# EAGLE design tracker2 (EAGLE 6.5.0)
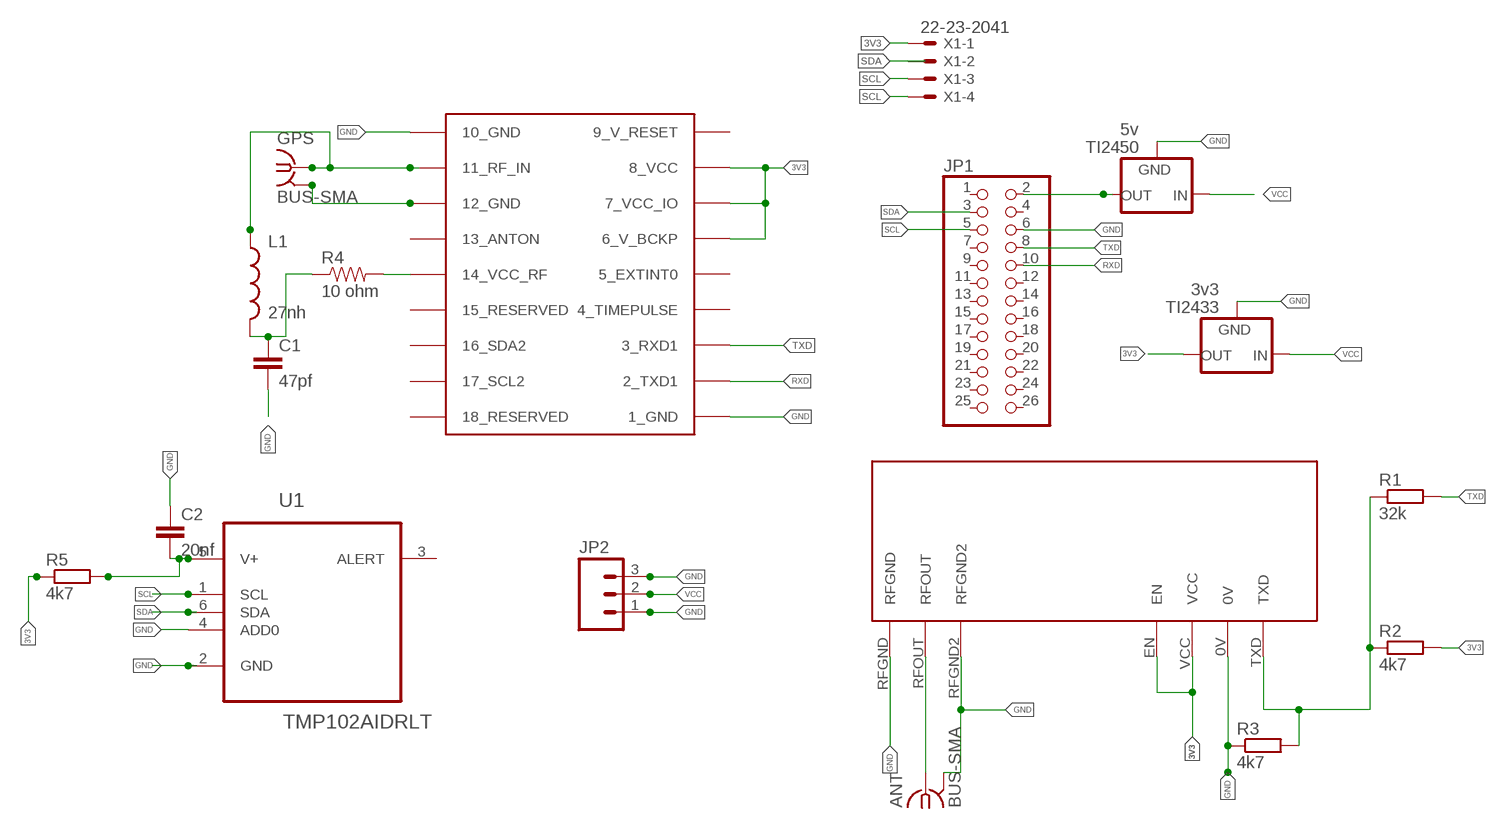
[diagram p0: schematic, sheet 1]

## Parts
ANT  BUS-SMA  [BUS-SMA]
C1  47pf  CAP0603-CAP  [0603-CAP]
C2  20nf  C-EUC0603  [C0603]
GPS  BUS-SMA  [BUS-SMA]
JP1  PINHD-2X13  [2X13]
JP2  M03PTH  [1X03]
L1  27nh  INDUCTOR0603  [0603]
R1  32k  R-EU_R0603  [R0603]
R2  4k7  R-EU_R0603  [R0603]
R3  4k7  R-EU_R0603  [R0603]
R4  10 ohm  RESISTOR0603  [0603-RES]
R5  4k7  R-EU_R0603  [R0603]
TI2433  3v3  V_REG_78XX-TO-220  [TO-220-ALT]
TI2450  5v  V_REG_78XX-TO-220  [TO-220-ALT]
U1  TMP102AIDRLT  [SOT50P160X60-6N]
U$1  NTX2  [NTX2]
U$2  UBLOX_MAX  [UBLOX_MAX]
X1  22-23-2041  [22-23-2041]

## Nets
3V3: C2.2 R2.2 R5.1 R5.2 TI2433.OUT U1.5(V+) U$1.EN U$1.VCC U$2.6_V_BCKP U$2.7_VCC_IO U$2.8_VCC X1.1
GND: ANT.2(GND) ANT.3(GND) ANT.4(GND) ANT.5(GND) C1.2 C2.1 GPS.2(GND) GPS.3(GND) GPS.4(GND) GPS.5(GND) JP1.6 JP2.1 JP2.3 R3.1 TI2433.GND TI2450.GND U1.2(GND) U1.4(ADD0) U$1.0V U$1.RFGND U$1.RFGND2 U$2.1_GND U$2.10_GND U$2.12_GND X1.4
N$1: JP1.2 TI2450.OUT
N$2: R4.2 U$2.14_VCC_RF
N$3: C1.1 L1.2 R4.1
N$6: R1.1 R2.1 R3.2 U$1.TXD
N$9: ANT.1 U$1.RFOUT
N$13: GPS.1 L1.1 U$2.11_RF_IN
RXD: JP1.10 U$2.2_TXD1
SCL: JP1.5 U1.1(SCL) X1.3
SDA: JP1.3 U1.6(SDA) X1.2
TXD: JP1.8 R1.2 U$2.3_RXD1
VCC: JP2.2 TI2433.IN TI2450.IN
Unconnected: JP1.1 JP1.4 JP1.7 JP1.9 JP1.11 JP1.12 JP1.13 JP1.14 JP1.15 JP1.16 JP1.17 JP1.18 JP1.19 JP1.20 JP1.21 JP1.22 JP1.23 JP1.24 JP1.25 JP1.26 U1.3(ALERT) U$2.4_TIMEPULSE U$2.5_EXTINT0 U$2.13_ANTON U$2.15_RESERVED U$2.16_SDA2 U$2.17_SCL2 U$2.18_RESERVED

## Power pins joined to a net without a drawn wire
9_V_RESET: U$2.9_V_RESET

## Library data of the parts
ANT GPS = Ava:BUS-SMA
C1 = SparkFun-Capacitors:CAP: Capacitor Standard 0603 ceramic capacitor, and 0.1" leaded capacitor.
C2 = rcl:C-EU: CAPACITOR, European symbol
JP1 = pinhead:PINHD-2X13: PIN HEADER
JP2 = SparkFun-Connectors:M03: Header 3 Standard 3-pin 0.1" header. Use with straight break away headers (SKU : PRT-00116), right angle break away headers (PRT-00553), swiss pins (PRT-00743), machine pins (PRT-00117), and female headers (PRT-00115). Molex polarized connector foot print use with SKU : PRT-08232 with associated crimp pins and housings.
L1 = SparkFun-Passives:INDUCTOR: Inductors Basic Inductor/Choke - 0603 and 1206. Footprints are not proven and vary greatly between part numbers. SRN6045- 33uH, 20% 1.4A SDR0403-560KL - 56uH, 10%, 500mA RMS/740mA peak
R1-R3 R5 = rcl:R-EU_: RESISTOR, European symbol
R4 = SparkFun-Resistors:RESISTOR: Resistor Basic schematic elements and footprints for 0603, 1206, and PTH resistors.
TI2433 TI2450 = SparkFun-PowerIC:V_REG_78XX: Voltage Regulator Standard 7805 5V regulator. IGO (Input Ground Output). Spark Fun Electronics SKU : COM-00107
U1 = Ava:TMP102AIDRLT: Temperature Sensor; MPN: TMP102AIDRLT; OC_FARNELL: 1652477; OC_NEWARK: 53M3987; PACKAGE: SOT-23-6; SUPPLIER: Texas Instruments
U$1 = Ava:NTX2: Radiometrix NTX2 Transmitter Module Author Anthony Stirk / http://ava.upuaut.net
U$2 = Ava:UBLOX_MAX: UBLOX MAX
X1 = con-molex:22-23-2041: .100" (2.54mm) Center Header - 4 Pin; MF: MOLEX; MPN: 22-23-2041; OC_FARNELL: 1462920; OC_NEWARK: 38C0355

## Net classes
0 default: clearance 0.205 mm

## Board
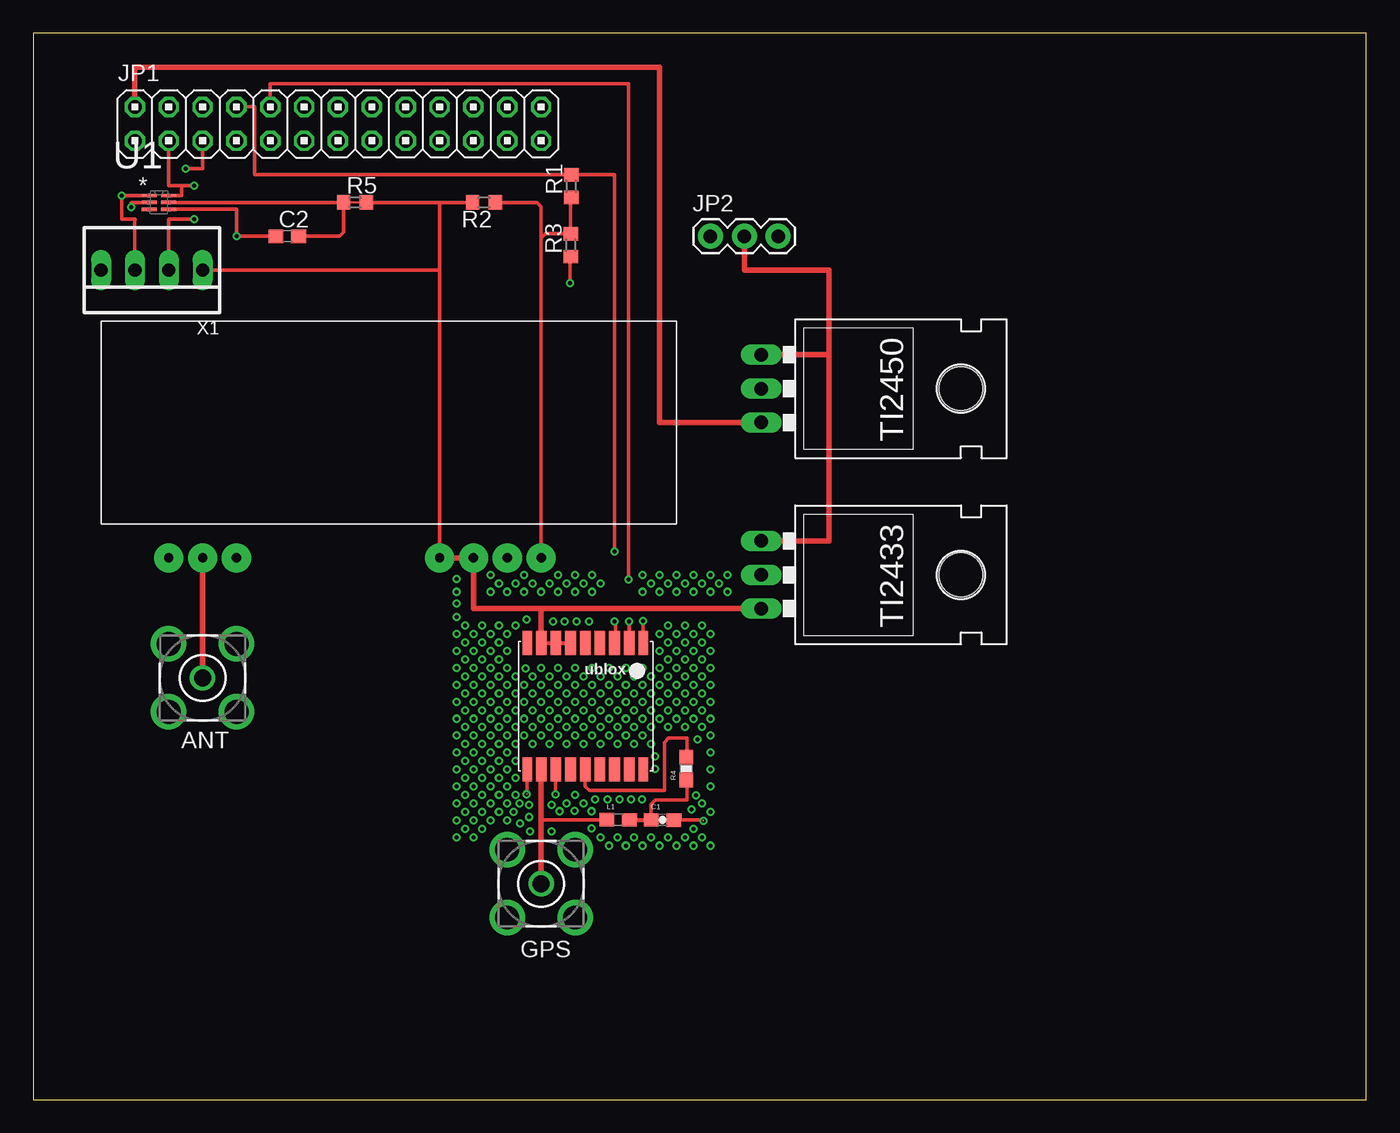
[diagram p1: board, top side]
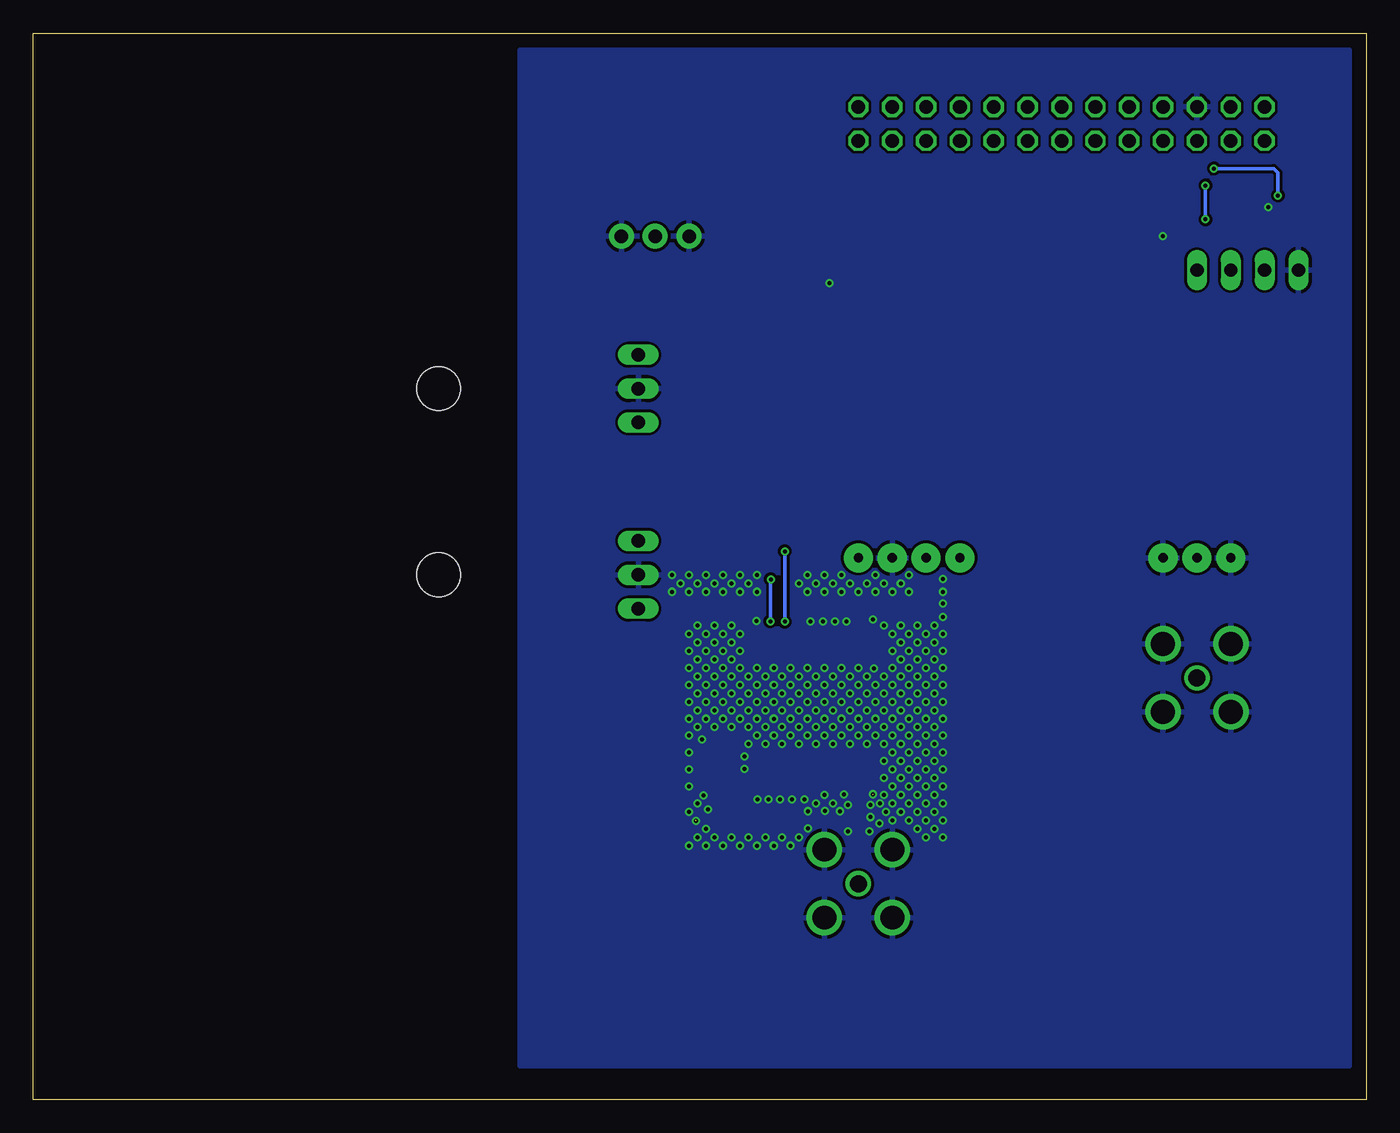
[diagram p2: board, bottom side, seen from below]

Size 100 x 80 mm. Coordinates in mm from the lower left corner, seen from the top.
Outline: 0,0 100,0 100,80 0,80 0,0
Copper layers (1*16): Top 0.035mm / dielectric 1.5mm / Bottom 0.035mm
Design rules "hackvana": minimum track width 6mil, minimum drill 0.3mm, track to track 6mil, track to pad 6mil, pad to pad 6mil, via to via 6mil, smd to smd 0mil, copper to edge 6mil, drill to drill 6mil, minimum pad ring 10mil, minimum via ring 6mil, stop-mask expansion 2mil, vias tented up to drill 100mil, thermal gap 10mil

### Footprints (pad centres in the part's own frame; a part is rotated, then mirrored left to right if it is on the bottom)
BUS-SMA = drill 1.27: 1 0,0 | drill 1.778: 2 -2.55,2.55; 3 2.55,2.55; 4 2.55,-2.55; 5 -2.55,-2.55
0603-CAP = smd 1.1 x 1: 1 -0.85,0; 2 0.85,0
C0603 = smd 1.1 x 1: 1 -0.85,0; 2 0.85,0
2X13 = drill 1.016 octagon: 1 -15.24,-1.27; 2 -15.24,1.27; 3 -12.7,-1.27; 4 -12.7,1.27; 5 -10.16,-1.27; 6 -10.16,1.27; 7 -7.62,-1.27; 8 -7.62,1.27; 9 -5.08,-1.27; 10 -5.08,1.27; 11 -2.54,-1.27; 12 -2.54,1.27; 13 0,-1.27; 14 0,1.27; 15 2.54,-1.27; 16 2.54,1.27; 17 5.08,-1.27; 18 5.08,1.27; 19 7.62,-1.27; 20 7.62,1.27; 21 10.16,-1.27; 22 10.16,1.27; 23 12.7,-1.27; 24 12.7,1.27; 25 15.24,-1.27; 26 15.24,1.27
1X03 = drill 1.016 pad 1.88: 1 0,0; 2 2.54,0; 3 5.08,0
0603 = smd 1.1 x 1: 1 -0.85,0; 2 0.85,0
R0603 = smd 1 x 1.1: 1 -0.85,0; 2 0.85,0
0603-RES = smd 1.1 x 1: 1 -0.85,0; 2 0.85,0
TO-220-ALT = drill 1.016 long: GND 0,-3.81; IN -2.54,-3.81; OUT 2.54,-3.81 | hole 3.302: 0,11.176
SOT50P160X60-6N = smd 1.118 x 0.254: 1 -0.737,0.508; 2 -0.737,0; 3 -0.737,-0.508; 4 0.737,-0.508; 5 0.737,0; 6 0.737,0.508
NTX2 = drill 0.7 pad 2.184: 0V -2.54,-10.16; EN -7.62,-10.16; RFGND -22.86,-10.16; RFGND2 -27.94,-10.16; RFOUT -25.4,-10.16; TXD 0,-10.16; VCC -5.08,-10.16
UBLOX_MAX = smd 1.8 x 0.7: 1_GND 4.95,-4.4; 9_V_RESET 4.95,4.3; 10_GND -4.55,4.3; 18_RESERVED -4.55,-4.4 | smd 1.8 x 0.8: 2_TXD1 4.95,-3.35; 3_RXD1 4.95,-2.25; 4_TIMEPULSE 4.95,-1.15; 5_EXTINT0 4.95,-0.05; 6_V_BCKP 4.95,1.05; 7_VCC_IO 4.95,2.15; 8_VCC 4.95,3.25; 11_RF_IN -4.55,3.25; 12_GND -4.55,2.15; 13_ANTON -4.55,1.05; 14_VCC_RF -4.55,-0.05; 15_RESERVED -4.55,-1.15; 16_SDA2 -4.55,-2.25; 17_SCL2 -4.55,-3.35
22-23-2041 = drill 1 long: 1 -3.81,0; 2 -1.27,0; 3 1.27,0; 4 3.81,0

### Placement (x,y rotation side)
ANT  12.7,31.63 0 top
C1  47.21,20.98 359.2 top
C2  19.05,64.77 0 top
GPS  38.1,16.19 0 top
JP1  22.86,73.21 0 top
JP2  50.8,64.77 0 top
L1  43.87,20.99 359.4 top
R1  40.36,68.54 90 top
R2  33.8,67.31 180 top
R3  40.31,64.09 90 top
R4  48.99,24.83 90 top
R5  24.13,67.31 0 top
TI2433  58.42,39.37 270 top
TI2450  58.42,53.34 270 top
U1  9.42,67.31 0 top
U$1  38.1,50.8 0 top
U$2  41.35,29.32 90 top
X1  8.89,62.23 180 top

### Tracks (layer width: path | path; a pad name or v marks a point on that pad's centre or on a via)
3V3
  Top 0.152: R5.2 R5.1
  Top 0.254: U1.5 R5.1 23.28,65.09 22.96,64.77 C2.2 | R5.2 30.48,67.31 | 30.48,67.31 32.32,67.31 R2.2 | U$1.EN 30.16,40.64 29.84,40.96 30.16,40.96 30.48,41.27 30.48,62.23 | 30.48,62.23 30.48,67.31 | X1.1 30.48,62.23
  Top 0.305: U$2.6_V_BCKP U$2.7_VCC_IO U$2.8_VCC
  Top 0.406: TI2433.OUT 38.1,36.83 | 38.1,36.83 33.02,36.83 U$1.VCC U$1.EN | U$2.8_VCC 38.1,36.83
GND  (via drill 0.3)  (3 unrouted)
  Top 0.254: C2.1 v15.24,64.77 15.24,66.8 U1.4 | U$2.1_GND v45.74,35.91 | U$2.10_GND 37.05,22.94 | U$2.12_GND 39.17,24.74 39.17,22.91 | C1.2 50.29,20.97 50.32,20.94 | U1.2 7.34,67.31 v7.34,66.95 | R3.1 40.28,63.24 v40.28,61.26
  other vias: 37.02,22.91 39.17,22.89 50.27,20.91 36.94,32.34 38.1,32.38 39.37,32.38 40.64,32.38 41.91,32.38 43.18,32.38 44.45,32.38 45.72,32.38 46.99,32.38 48.26,32.38 49.53,32.38 50.8,32.38 50.8,31.11 49.53,31.11 48.26,31.11 46.99,31.11 45.72,31.11 44.45,31.11 43.18,31.11 41.91,31.11 40.64,31.11 39.37,31.11 38.1,31.11 36.83,31.11 35.56,31.11 34.29,31.11 33.02,31.11 33.02,32.38 34.29,32.38 35.56,32.38 35.56,33.66 34.29,33.66 33.02,33.66 33.02,34.92 34.29,34.92 35.56,34.92 33.02,29.84 34.29,29.84 35.56,29.84 36.83,29.84 38.1,29.84 39.37,29.84 40.64,29.84 41.91,29.84 43.18,29.84 44.45,29.84 45.72,29.84 46.99,29.84 48.26,29.84 49.53,29.84 50.8,29.84 33.02,28.57 34.29,28.57 35.56,28.57 36.83,28.57 38.1,28.57 39.37,28.57 40.64,28.57 41.91,28.57 43.18,28.57 44.45,28.57 45.72,28.57 46.99,28.57 48.26,28.57 49.53,28.57 50.8,28.57 46.99,33.66 48.26,33.66 49.53,33.66 50.8,33.66 46.99,34.92 48.26,34.92 49.53,34.92 50.8,34.92 33.02,27.3 34.29,27.3 35.56,27.3 36.83,27.3 38.1,27.3 39.37,27.3 40.64,27.3 41.91,27.3 43.18,27.3 44.45,27.3 45.72,27.3 50.8,27.3 33.02,26.04 34.29,26.04 35.56,26.04 33.02,24.77 34.29,24.77 35.56,24.77 33.02,23.5 34.29,23.5 35.56,23.5 33.02,22.23 34.29,22.23 35.56,22.23 33.02,20.95 34.29,20.95 35.56,20.95 40.64,22.86 40.01,22.23 41.27,22.23 50.16,22.23 50.8,26.04 50.8,24.77 50.8,23.5 43.18,19.05 44.45,19.05 45.72,19.05 46.99,19.05 48.26,19.05 49.53,19.05 50.8,19.05 33.02,19.68 41.27,26.67 42.55,26.67 43.81,26.67 45.09,26.67 40.01,26.67 38.73,26.67 37.47,26.67 37.47,27.94 38.73,27.94 40.01,27.94 41.27,27.94 42.55,27.94 43.81,27.94 45.09,27.94 45.09,29.21 43.81,29.21 42.55,29.21 41.27,29.21 40.01,29.21 38.73,29.21 37.47,29.21 37.47,30.48 38.73,30.48 40.01,30.48 41.27,30.48 42.55,30.48 43.81,30.48 45.09,30.48 37.47,31.75 38.73,31.75 40.01,31.75 41.27,31.75 42.55,31.75 43.81,31.75 45.09,31.75 33.66,33.02 33.66,34.29 33.66,31.75 33.66,30.48 33.66,29.21 33.66,27.94 33.66,26.67 33.66,25.4 33.66,24.13 33.66,22.86 33.66,21.59 33.66,20.32 34.92,21.59 34.92,22.86 34.92,24.13 34.92,25.4 34.92,26.67 34.92,27.94 34.92,29.21 34.92,30.48 34.92,31.75 34.92,33.02 34.92,34.29 36.2,31.75 36.2,30.48 36.2,29.21 36.2,27.94 36.2,26.67 36.2,25.4 36.2,24.13 36.2,22.86 47.62,34.29 47.62,33.02 47.62,31.75 47.62,30.48 47.62,29.21 47.62,27.94 48.9,27.94 48.9,29.21 48.9,30.48 48.9,31.75 48.9,33.02 48.9,34.29 50.16,34.29 50.16,33.02 50.16,31.75 50.16,30.48 50.16,29.21 50.16,27.94 50.8,21.59 50.16,19.68 46.35,26.67 46.35,31.75 46.35,30.48 46.35,29.21 46.35,27.94 33.66,35.56 34.92,35.56 36.2,35.56 47.62,35.56 48.9,35.56 50.16,35.56 38.99,35.88 39.85,35.86 40.76,35.88 41.7,35.86 45.72,39.37 46.99,39.37 48.26,39.37 49.53,39.37 50.8,39.37 46.35,38.73 47.62,38.73 48.9,38.73 50.16,38.73 46.99,38.1 45.72,38.1 48.26,38.1 49.53,38.1 50.8,38.1 51.44,38.73 52.07,39.37 52.07,38.1 32.38,35.56 32.38,34.29 32.38,33.02 32.38,31.75 32.38,30.48 32.38,29.21 32.38,27.94 32.38,26.67 32.38,25.4 32.38,24.13 32.38,22.86 32.38,21.59 32.38,20.32 31.75,19.68 31.75,20.95 31.75,22.23 31.75,23.5 31.75,24.77 31.75,26.04 31.75,27.3 31.75,28.57 31.75,29.84 31.75,31.11 31.75,32.38 31.75,33.66 31.75,34.92 37.27,20.13 36.51,20.71 36.05,21.59 38.87,22.1 40.61,21.64 42.13,22.5 43.07,22.53 43.98,22.5 44.84,22.5 45.68,22.5 46.63,24.81 46.63,25.74 49.82,27.01 49.39,21.77 49.71,22.83 37.2,22.11 37.2,21.19 31.75,36.2 37.02,36.01 31.76,39.07 31.75,37.21 34.29,38.1 35.56,38.1 36.83,38.1 38.1,38.1 39.37,38.1 40.64,38.1 41.27,38.73 40.01,38.73 38.73,38.73 37.47,38.73 36.2,38.73 34.92,38.73 39.37,39.37 40.64,39.37 41.91,39.37 42.55,38.73 41.91,38.1 36.83,39.37 34.29,39.37 31.75,38.1 38.89,20.12 41.87,21.64 39.48,21.64 49.53,20.32 48.9,19.68 46.35,19.68 47.62,19.68 45.09,19.68 43.81,19.68 42.55,19.68 41.87,20.35 36.48,22.21
  pour Bottom: 1.27,78.74 63.5,78.74 63.5,2.54 1.27,2.54
N$1
  Top 0.406: TI2450.OUT 46.99,50.8 46.99,77.47 7.62,77.47 JP1.2
N$2
  Top 0.254: R4.2 49.02,25.72 49.02,27.13 47.67,27.13 47.36,26.81 47.36,23.18 41.72,23.18 41.4,23.5 U$2.14_VCC_RF
N$3
  Top 0.254: R4.1 49.02,23.93 49.02,22.47 46.68,22.47 46.36,22.15 C1.1
  Top 0.305: C1.1 46.19,20.99 46.19,20.95 | 46.19,20.95 46.4,20.95 | 46.19,20.95 44.72,20.95 L1.2 | R4.1
N$6
  Top 0.254: 38.1,64.64 U$1.TXD | 38.1,64.64 38.42,64.95 40.31,64.95 R3.2 40.31,67.69 R1.1 | R2.1 37.78,67.31 38.1,66.99 38.1,64.64
  Top 0.406: U$1.TXD
N$9
  Top 0.406: U$1.RFOUT ANT.1
N$13
  Top 0.254: 38.1,20.99 L1.1
  Top 0.305: 38.16,18.34 38.1,18.4 | 38.1,20.99 38.1,21.59
  Top 0.406: U$2.11_RF_IN 38.1,21.59 38.1,20.75 38.1,18.4 GPS.1
RXD  (via drill 0.3)
  Top 0.254: JP1.10 17.78,76.2 44.65,76.2 44.65,74.78 44.67,74.78 v44.67,39.02
  Top 0.305: 44.73,35.88 v44.7,35.88 U$2.2_TXD1
  Bottom 0.254: v44.67,39.02 44.7,38.99 v44.7,35.88
  Bottom 0.305: 44.72,39.02 44.73,39.02
  Bottom 0.406: 44.72,39.02 v44.67,39.02
SCL  (via drill 0.3)
  Top 0.254: JP1.5 12.7,69.85 v11.43,69.85 | U1.1 v6.62,67.82 6.64,67.82 6.64,66.07 7.63,66.07 7.63,66.03 7.62,66.03 X1.3
  Bottom 0.254: v11.43,69.85 6.94,69.85 6.62,69.53 v6.62,67.82
SDA  (via drill 0.3)
  Top 0.254: JP1.3 10.16,68.58 10.79,68.58 11.12,68.58 | 11.12,68.58 11.12,67.81 U1.6 | X1.2 10.16,66.04 v12.06,66.04 | v12.06,68.58 11.12,68.58
  Top 0.406: JP1.3
  Bottom 0.254: v12.06,66.04 v12.06,68.58
TXD  (via drill 0.3)
  Top 0.254: JP1.8 16.61,74.48 16.61,69.38 R1.2 43.62,69.39 v43.62,41.12 | v43.62,35.85 43.67,35.85 43.67,34.33 U$2.3_RXD1
  Bottom 0.254: v43.62,41.12 v43.62,35.85
VCC
  Top 0.406: TI2450.IN 59.69,55.88 | 59.69,55.88 59.69,41.91 TI2433.IN | JP2.2 53.34,62.23 59.69,62.23 59.69,55.88